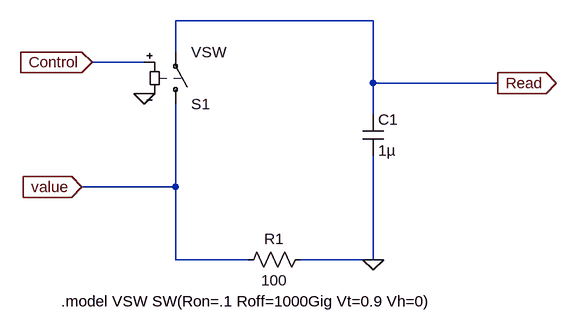
[diagram p0: schematic RAM_write_and_read_circuit.asc]
RAM_write_and_read_circuit.asc, the LTspice schematic file:
Version 4.1
SHEET 1 1012 848
WIRE 704 -48 400 -48
WIRE 400 0 400 -48
WIRE 352 16 272 16
WIRE 704 48 704 -48
WIRE 896 48 704 48
WIRE 704 96 704 48
WIRE 400 208 400 80
WIRE 400 208 256 208
WIRE 400 320 400 208
WIRE 512 320 400 320
WIRE 704 320 704 160
WIRE 704 320 592 320
FLAG 352 64 0
FLAG 704 320 0
FLAG 272 16 Control
IOPIN 272 16 In
FLAG 256 208 value
IOPIN 256 208 In
FLAG 896 48 Read
IOPIN 896 48 Out
SYMBOL sw 400 96 M180
SYMATTR InstName S1
SYMATTR Value VSW
SYMBOL cap 688 96 R0
SYMATTR InstName C1
SYMATTR Value 1µ
SYMBOL res 608 304 R90
WINDOW 0 0 56 VBottom 2
WINDOW 3 32 56 VTop 2
SYMATTR InstName R1
SYMATTR Value 100
TEXT 224 384 Left 2 !.model VSW SW(Ron=.1 Roff=1000Gig Vt=0.9 Vh=0)

The netlist it stands for:
* RAM_write_and_read_circuit.asc
S1 value Read Control 0 VSW
C1 Read 0 1µ
R1 0 value 100
.model VSW SW(Ron=.1 Roff=1000Gig Vt=0.9 Vh=0)
.backanno
.end